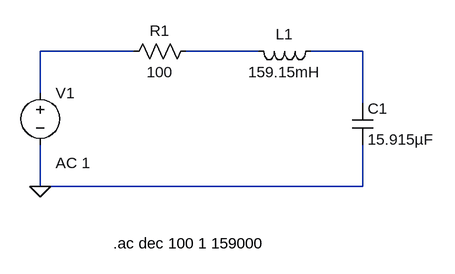
[diagram p0: schematic RetoPBF.asc]
RetoPBF.asc, the LTspice schematic file:
Version 4.1
SHEET 1 880 680
WIRE 208 304 64 304
WIRE 400 304 288 304
WIRE 560 304 480 304
WIRE 64 368 64 304
WIRE 560 384 560 304
WIRE 64 512 64 448
WIRE 560 512 560 448
WIRE 560 512 64 512
FLAG 64 512 0
SYMBOL voltage 64 352 R0
WINDOW 123 24 124 Left 2
WINDOW 39 0 0 Left 0
SYMATTR InstName V1
SYMATTR Value ""
SYMATTR Value2 AC 1
SYMBOL res 304 288 R90
WINDOW 0 0 56 VBottom 2
WINDOW 3 32 56 VTop 2
SYMATTR InstName R1
SYMATTR Value 100
SYMBOL ind 496 288 R90
WINDOW 0 5 56 VBottom 2
WINDOW 3 32 56 VTop 2
SYMATTR InstName L1
SYMATTR Value 159.15mH
SYMBOL cap 544 384 R0
SYMATTR InstName C1
SYMATTR Value 15.915µF
TEXT 176 600 Left 2 !.ac dec 100 1 159000

The netlist it stands for:
* RetoPBF.asc
V1 N001 0 AC 1
R1 N002 N001 100
L1 N003 N002 159.15mH
C1 N003 0 15.915µF
.ac dec 100 1 159000
.backanno
.end